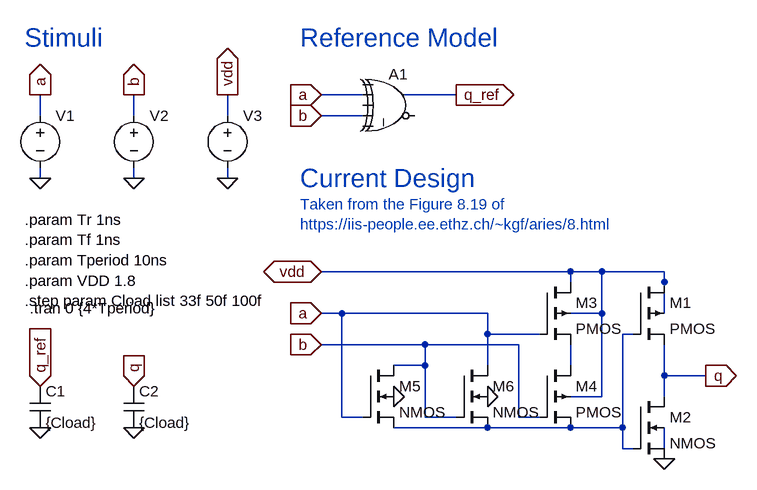
[diagram p0: schematic xor_ethz_ch.asc]
xor_ethz_ch.asc, the LTspice schematic file:
Version 4
SHEET 1 1032 848
WIRE 224 256 160 256
WIRE 368 256 288 256
WIRE -272 288 -272 256
WIRE -128 288 -128 256
WIRE 16 288 16 256
WIRE 224 288 160 288
WIRE -272 384 -272 368
WIRE -128 384 -128 368
WIRE 16 384 16 368
WIRE 544 528 160 528
WIRE 592 528 544 528
WIRE 688 528 592 528
WIRE 544 544 544 528
WIRE 688 544 688 528
WIRE 192 592 160 592
WIRE 416 592 192 592
WIRE 592 592 592 528
WIRE 592 592 544 592
WIRE 688 592 688 544
WIRE 416 624 416 592
WIRE 496 624 416 624
WIRE 640 624 624 624
WIRE 320 640 160 640
WIRE 464 640 320 640
WIRE 320 672 320 640
WIRE 320 672 272 672
WIRE 416 672 416 624
WIRE 544 672 544 640
WIRE 688 688 688 640
WIRE 752 688 688 688
WIRE 592 720 592 592
WIRE 592 720 544 720
WIRE 688 720 688 688
WIRE 192 752 192 592
WIRE 224 752 192 752
WIRE 320 752 320 672
WIRE 368 752 320 752
WIRE 464 752 464 640
WIRE 496 752 464 752
WIRE 416 768 272 768
WIRE 544 768 416 768
WIRE 624 768 624 624
WIRE 624 768 544 768
WIRE 624 800 624 768
WIRE 640 800 624 800
WIRE 688 816 688 768
FLAG -128 384 0
FLAG -272 384 0
FLAG -272 256 a
IOPIN -272 256 Out
FLAG -128 256 b
IOPIN -128 256 Out
FLAG 160 256 a
IOPIN 160 256 In
FLAG 160 288 b
IOPIN 160 288 In
FLAG 368 256 q_ref
IOPIN 368 256 Out
FLAG 160 592 a
IOPIN 160 592 In
FLAG 160 640 b
IOPIN 160 640 In
FLAG 752 688 q
IOPIN 752 688 Out
FLAG 688 816 0
FLAG 272 720 0
FLAG 416 720 0
FLAG -128 768 0
FLAG -272 768 0
FLAG -128 704 q
IOPIN -128 704 In
FLAG -272 704 q_ref
IOPIN -272 704 In
FLAG 16 384 0
FLAG 16 256 vdd
IOPIN 16 256 Out
FLAG 160 528 vdd
IOPIN 160 528 BiDir
SYMBOL Digital/xor 272 208 R0
SYMATTR InstName A1
SYMATTR Value2 Vhigh={VDD} Vt={VDD/2}
SYMBOL voltage -272 272 R0
WINDOW 3 24 96 Invisible 2
SYMATTR Value PULSE(0 {VDD} 0 {Tr} {Tf} {Tperiod/2-Tr} {Tperiod})
SYMATTR InstName V1
SYMBOL voltage -128 272 R0
WINDOW 3 24 96 Invisible 2
SYMATTR Value PULSE(0 {VDD} 0 {Tr} {Tf} {Tperiod-Tr} {2*Tperiod})
SYMATTR InstName V2
SYMBOL pmos4 640 544 R0
SYMATTR InstName M1
SYMATTR Value2 l=0.18u w=1u m=2
SYMBOL nmos4 640 720 R0
SYMATTR InstName M2
SYMATTR Value2 l=0.18u w=1u m=2
SYMBOL pmos4 496 544 R0
SYMATTR InstName M3
SYMATTR Value2 l=0.18u w=1u
SYMBOL pmos4 496 672 R0
SYMATTR InstName M4
SYMATTR Value2 l=0.18u w=1u
SYMBOL nmos4 224 672 R0
SYMATTR InstName M5
SYMATTR Value2 l=0.18u w=1u
SYMBOL nmos4 368 672 R0
SYMATTR InstName M6
SYMATTR Value2 l=0.18u w=1u
SYMBOL cap -288 704 R0
SYMATTR InstName C1
SYMATTR Value {Cload}
SYMBOL cap -144 704 R0
SYMATTR InstName C2
SYMATTR Value {Cload}
SYMBOL voltage 16 272 R0
WINDOW 3 24 96 Invisible 2
SYMATTR Value {VDD}
SYMATTR InstName V3
TEXT 128 168 Left 4 ;Reference Model
TEXT 128 384 Left 4 ;Current Design
TEXT -296 168 Left 4 ;Stimuli
TEXT -296 448 Left 2 !.param Tr 1ns\n.param Tf 1ns\n.param Tperiod 10ns\n.param VDD 1.8\n.step param Cload list 33f 50f 100f
TEXT 128 424 Left 2 ;Taken from the Figure 8.19 of\nhttps://iis-people.ee.ethz.ch/~kgf/aries/8.html
TEXT -288 584 Left 2 !.tran 0 {4*Tperiod}

The netlist it stands for:
* xor_ethz_ch.asc
A1 0 a 0 b 0 0 q_ref 0 XOR Vhigh={VDD} Vt={VDD/2}
V1 a 0 PULSE(0 {VDD} 0 {Tr} {Tf} {Tperiod/2-Tr} {Tperiod})
V2 b 0 PULSE(0 {VDD} 0 {Tr} {Tf} {Tperiod-Tr} {2*Tperiod})
M1 vdd N001 q vdd PMOS l=0.18u w=1u m=2
M2 q N001 0 0 NMOS l=0.18u w=1u m=2
M3 vdd a N002 vdd PMOS l=0.18u w=1u
M4 N002 b N001 vdd PMOS l=0.18u w=1u
M5 b a N001 0 NMOS l=0.18u w=1u
M6 a b N001 0 NMOS l=0.18u w=1u
C1 q_ref 0 {Cload}
C2 q 0 {Cload}
V3 vdd 0 {VDD}
.model NMOS NMOS
.model PMOS PMOS
.lib standard.mos
* Reference Model
* Current Design
* Stimuli
.param Tr 1ns
.param Tf 1ns
.param Tperiod 10ns
.param VDD 1.8
.step param Cload list 33f 50f 100f
* Taken from the Figure 8.19 of
* https://iis-people.ee.ethz.ch/~kgf/aries/8.html
.tran 0 {4*Tperiod}
.backanno
.end